# EAGLE design xmas_v2 (EAGLE 7.4.0)
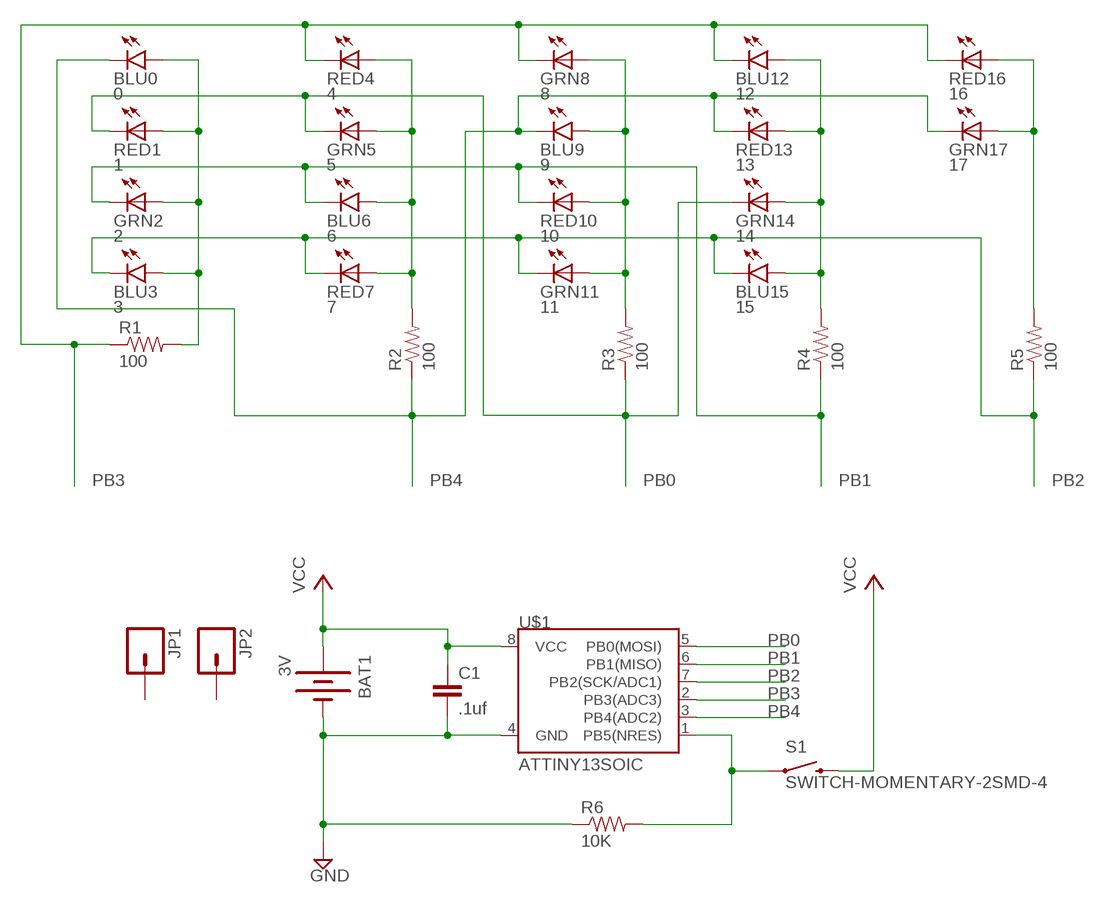
[diagram p0: schematic, sheet 1]

## Parts
BAT1  3V  BATTERY20PTH  [BATTCOM_20MM_PTH]
BLU0  0  LED5MM-KIT  [LED5MM-KIT]
BLU3  3  LED5MM-KIT  [LED5MM-KIT]
BLU6  6  LED5MM-KIT  [LED5MM-KIT]
BLU9  9  LED5MM-KIT  [LED5MM-KIT]
BLU12  12  LED5MM-KIT  [LED5MM-KIT]
BLU15  15  LED5MM-KIT  [LED5MM-KIT]
C1  .1uf  CAP0805  [0805]
GRN2  2  LEDCHIPLED_0805  [CHIPLED_0805]
GRN5  5  LEDCHIPLED_0805  [CHIPLED_0805]
GRN8  8  LEDCHIPLED_0805  [CHIPLED_0805]
GRN11  11  LEDCHIPLED_0805  [CHIPLED_0805]
GRN14  14  LEDCHIPLED_0805  [CHIPLED_0805]
GRN17  17  LEDCHIPLED_0805  [CHIPLED_0805]
JP1  M01NOSILK-KIT  [1X01NS-KIT]
JP2  M01NOSILK-KIT  [1X01NS-KIT]
R1  100  RESISTOR0805-RES  [0805]
R2  100  RESISTOR0805-RES  [0805]
R3  100  RESISTOR0805-RES  [0805]
R4  100  RESISTOR0805-RES  [0805]
R5  100  RESISTOR0805-RES  [0805]
R6  10K  RESISTOR0805-RES  [0805]
RED1  1  LEDCHIPLED_0805  [CHIPLED_0805]
RED4  4  LEDCHIPLED_0805  [CHIPLED_0805]
RED7  7  LEDCHIPLED_0805  [CHIPLED_0805]
RED10  10  LEDCHIPLED_0805  [CHIPLED_0805]
RED13  13  LEDCHIPLED_0805  [CHIPLED_0805]
RED16  16  LEDCHIPLED_0805  [CHIPLED_0805]
S1  SWITCH-MOMENTARY-2SMD-4  [TACTILE_SWITCH_TALL]
U$1  ATTINY13SOIC  [SO08]

## Nets
GND: BAT1.2(-) C1.2 R6.1 U$1.4(GND)
N$1: BLU0.A BLU3.A GRN2.A R1.2 RED1.A
N$2: BLU6.A GRN5.A R2.2 RED4.A RED7.A
N$3: BLU9.A GRN8.A GRN11.A R3.2 RED10.A
N$4: BLU12.A BLU15.A GRN14.A R4.2 RED13.A
N$5: GRN17.A R5.2 RED16.A
N$10: R6.2 S1.A2 U$1.1(PB5(NRES))
PB0: GRN5.C GRN14.C R3.1 RED1.C U$1.5(PB0(MOSI))
PB1: BLU6.K(C) GRN2.C R4.1 RED10.C U$1.6(PB1(MISO))
PB2: BLU3.K(C) BLU15.K(C) GRN11.C R5.1 RED7.C U$1.7(PB2(SCK/ADC1))
PB3: BLU12.K(C) GRN8.C R1.1 RED4.C RED16.C U$1.2(PB3(ADC3))
PB4: BLU0.K(C) BLU9.K(C) GRN17.C R2.1 RED13.C U$1.3(PB4(ADC2))
VCC: BAT1.1(+) C1.1 S1.B2 U$1.8(VCC)
Unconnected: JP1.1 JP2.1

## Library data of the parts
BAT1 = SparkFun-Electromechanical:BATTERY: Battery Holders Various common sizes : AA, AAA, 18650 (PRT-12895), 20mm coin cell and 12mm coin cell. 20MM_4LEGS, BATT-10373
BLU0 BLU3 BLU6 BLU9 BLU12 BLU15 = SparkFun-LED:LED: LEDs Standard schematic elements and footprints for 5mm, 3mm, 1206, and 0603 sized LEDs. 5mm - Spark Fun Electronics SKU : COM-00529 (and others)
C1 = SparkFun-Capacitors:CAP: Capacitor Standard 0603 ceramic capacitor, and 0.1" leaded capacitor.
GRN2 GRN5 GRN8 GRN11 GRN14 GRN17 RED1 RED4 RED7 RED10 RED13 RED16 = adafruit:LED: LED OSRAM: - CHIPLED LG R971, LG N971, LY N971, LG Q971, LY Q971, LO R971, LY R971 LH N974, LH R974 LS Q976, LO Q976, LY Q976 LO Q996 - Hyper CHIPLED LW Q18S LB Q993, LB Q99A, LB R99A - SideLED LS A670, LO A670, LY A670, LG A670, LP A670 LB A673, LV A673, LT A673, LW A673 LH A674 LY A675 LS A676, LA A676, LO A676, LY A676, LW A676 LS A679, LY A679, LG A679 - Hyper Micro SIDELED® LS Y876, LA Y876, LO Y876, LY Y876 LT Y87S - SmartLED LW L88C, LW L88S LB L89C, LB L89S, LG L890 LS L89K, LO L89K, LY L89K LS L896, LA L896, LO L896, LY L896 - TOPLED LS T670, LO T670, LY T670, LG T670, LP T670 LSG T670, LSP T670, LSY T670, LOP T670, LYG T670 LG T671, LOG T671, LSG T671 LB T673, LV T673, LT T673, LW T673 LH T674 LS T676, LA T676, LO T676, LY T676, LB T676, LH T676, LSB T676, LW T676 LB T67C, LV T67C, LT T67C, LS T67K, LO T67K, LY T67K, LW E67C LS E67B, LA E67B, LO E67B, LY E67B, LB E67C, LV E67C, LT E67C LW T67C LS T679, LY T679, LG T679 LS T770, LO T770, LY T770, LG T770, LP T770 LB T773, LV T773, LT T773, LW T773 LH T774 LS E675, LA E675, LY E675, LS T675 LS T776, LA T776, LO T776, LY T776, LB T776 LHGB T686 LT T68C, LB T68C - Hyper Mini TOPLED® LB M676 - Mini TOPLED Santana® LG M470 LS M47K, LO M47K, LY M47K Source: http://www.osram.convergy.de/
JP1 JP2 = SparkFun-Connectors:M01: Header 1 Standard 1-pin 0.1" header. Use with straight break away headers (SKU : PRT-00116), right angle break away headers (PRT-00553), swiss pins (PRT-00743), machine pins (PRT-00117), and female headers (PRT-00115). SMTSO-256-ET is a "flush mount" nut for a 4-40 screw. The older package used to be too tight, and did not allow it to sit properly thru the drill hit. The latest (0.165DIA) fits nice and snug.
R1-R6 = SparkFun-Passives:RESISTOR: Resistor Basic schematic elements and footprints for 0603, 1206, and PTH resistors.
S1 = SparkFun-Electromechanical:SWITCH-MOMENTARY-2: Various NO switches- pushbuttons, reed, etc; PROD_ID: SWCH-11966
U$1 = SparkFun-DigitalIC:ATTINY13: Atmel 8-pin 1kB flash uC

## Board
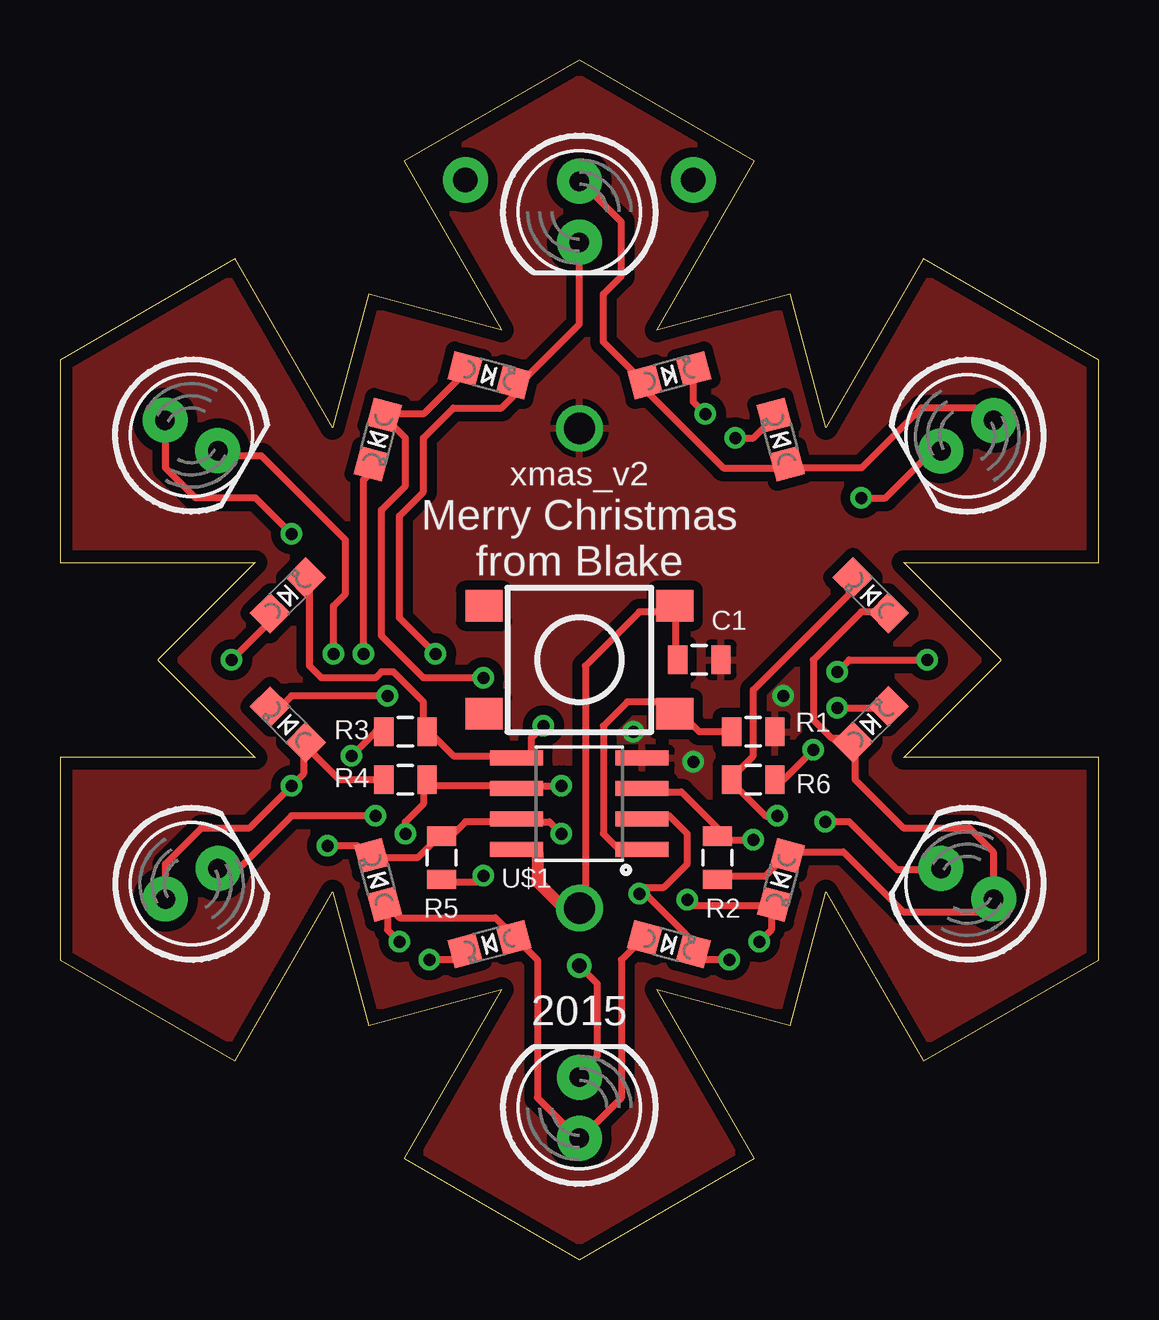
[diagram p1: board, top side]
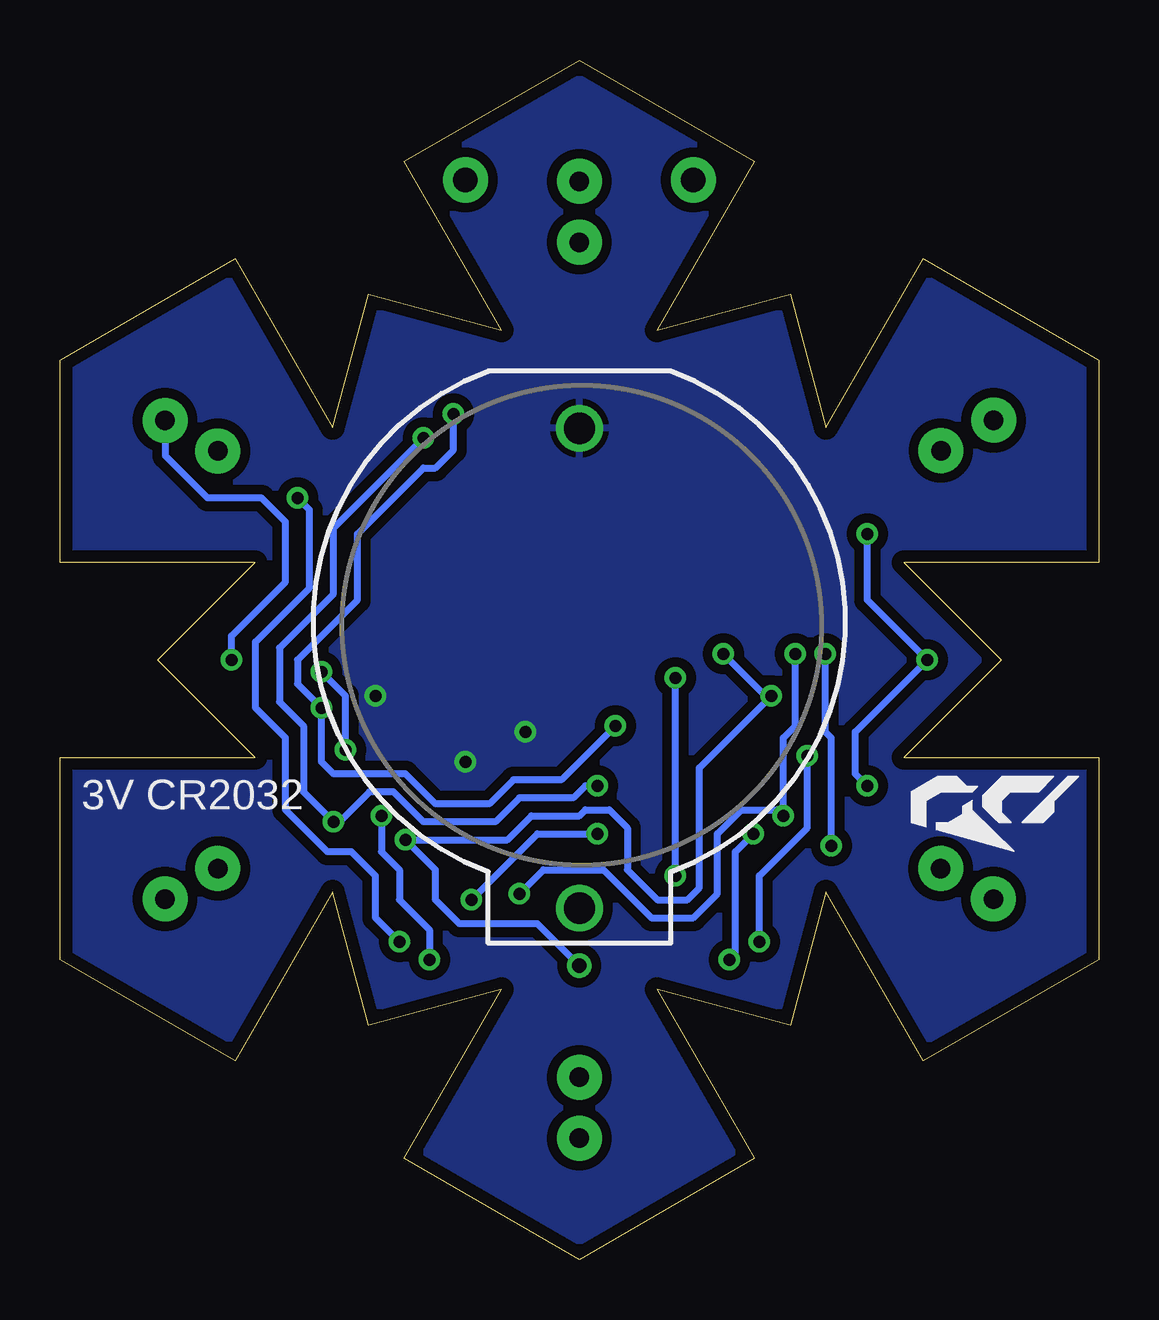
[diagram p2: board, bottom side, seen from below]

Size 43.3 x 50 mm. Coordinates in mm from the lower left corner, seen from the top.
Outline: 31.93,34.68 30.44,40.23 24.9,38.74 28.96,45.78 21.65,50 14.34,45.78 18.41,38.74 12.86,40.23 11.37,34.68 7.31,41.72 0,37.5 0,29.06 8.12,29.06 4.06,25 8.12,20.94 0,20.94 0,12.5 7.31,8.28 11.37,15.32 12.86,9.77 18.41,11.26 14.34,4.22 21.65,0 28.96,4.22 24.9,11.26 30.44,9.77 31.93,15.32 35.99,8.28 43.3,12.5 43.3,20.94 35.18,20.94 39.24,25 35.18,29.06 43.3,29.06 43.3,37.5 35.99,41.72 31.93,34.68
Copper layers (1*16): Top 0.035mm / dielectric 1.5mm / Bottom 0.035mm
Design rules "ITead_rule *": minimum track width 8mil, minimum drill 0.25mm, track to track 8mil, track to pad 8mil, pad to pad 8mil, via to via 8mil, smd to smd 8mil, copper to edge 20mil, drill to drill 10mil, minimum pad ring 12mil, minimum via ring 8mil, stop-mask expansion 4mil, vias tented up to drill 100mil, thermal gap 10mil

### Footprints (pad centres in the part's own frame; a part is rotated, then mirrored left to right if it is on the bottom)
BATTCOM_20MM_PTH = drill 1.3: 1 11.85,0; 2 -8.15,0
LED5MM-KIT = drill 0.813 pad 1.88: A -1.27,0; K 1.27,0
0805 = smd 0.8 x 1.2: 1 -0.9,0; 2 0.9,0
CHIPLED_0805 = smd 1.2 x 1.2: A 0,-1.05; C 0,1.05
1X01NS-KIT = drill 1.016 pad 1.88: 1 0,0
TACTILE_SWITCH_TALL = smd 1.55 x 1.3: A1 -3.975,-2.25; A2 3.975,-2.25; B1 -3.975,2.25; B2 3.975,2.25
SO08 = smd 0.61 x 2.21: 1 -1.905,-2.616; 2 -0.635,-2.616; 3 0.635,-2.616; 4 1.905,-2.616; 5 1.905,2.616; 6 0.635,2.616; 7 -0.635,2.616; 8 -1.905,2.616

### Placement (x,y rotation side)
BAT1  21.65,26.5 270 bottom
BLU0  21.65,43.67 270 top
BLU3  37.82,34.34 210 top
BLU6  37.82,15.66 150 top
BLU9  21.65,6.33 90 top
BLU12  5.49,15.66 30 top
BLU15  5.48,34.35 330 top
C1  26.65,25 0 top
GRN2  30.04,34.18 15 top
GRN5  33.8,22.32 315 top
GRN8  25.39,13.14 255 top
GRN11  13.26,15.82 15 top
GRN14  9.51,27.68 315 top
GRN17  17.9,36.86 255 top
JP1  26.4,45 0 top
JP2  16.9,45 0 top
R1  28.9,20 0 top
R2  27.4,16.75 270 top
R3  14.4,22 180 top
R4  14.4,20 180 top
R5  15.9,16.75 270 top
R6  28.9,22 180 top
RED1  25.4,36.86 285 top
RED4  33.79,27.69 45 top
RED7  30.05,15.82 165 top
RED10  17.9,13.15 105 top
RED13  9.51,22.3 45 top
RED16  13.25,34.18 165 top
S1  21.65,25 0 top
U$1  21.65,19 90 top

### Tracks (layer width: path | path; a pad name or v marks a point on that pad's centre or on a via)
GND  (via drill 0.5)
  other vias: 30.15,23.5 26.4,20.75 23.9,22
  pour Top (isolate 0.4): 31.93,34.68 30.44,40.23 24.9,38.74 28.96,45.78 21.65,50 14.34,45.78 18.41,38.74 12.86,40.23 11.37,34.68 7.31,41.72 0,37.5 0,29.06 8.12,29.06 4.06,25 8.12,20.94 0,20.94 0,12.5 7.31,8.28 11.37,15.32 12.86,9.77 18.41,11.26 14.34,4.22 21.65,0 28.96,4.22 24.9,11.26 30.44,9.77 31.93,15.32 35.99,8.28 43.3,12.5 43.3,20.94 35.18,20.94 39.24,25 35.18,29.06 43.3,29.06 43.3,37.5 35.99,41.72
  pour Bottom (isolate 0.4): 31.93,34.68 30.44,40.23 24.9,38.74 28.96,45.78 21.65,50 14.34,45.78 18.41,38.74 12.86,40.23 11.37,34.68 7.31,41.72 0,37.5 0,29.06 8.12,29.06 4.06,25 8.12,20.94 0,20.94 0,12.5 7.31,8.28 11.37,15.32 12.86,9.77 18.41,11.26 14.34,4.22 21.65,0 28.96,4.22 24.9,11.26 30.44,9.77 31.93,15.32 35.99,8.28 43.3,12.5 43.3,20.94 35.18,20.94 39.24,25 35.18,29.06 43.3,29.06 43.3,37.5 35.99,41.72
N$1  (via drill 0.5)
  Top 0.3: BLU3.A 38.65,35 38.15,35.5 35.9,35.5 33.4,33 30.65,33 GRN2.A 29.9,33 27.65,33 24.4,36.25 RED1.A 24.15,36.75 22.65,38.25 22.65,40.25 23.4,41 23.4,43.25 22.15,44.5 BLU0.A | R1.2 30.15,20 v31.4,21.25 | v32.4,24.5 32.9,25 v36.15,25
  Bottom 0.3: v31.4,21.25 31.4,23.5 v32.4,24.5 | v36.15,25 36.15,26 33.9,28.25 33.9,30.75 34.9,31.75 37.15,31.75 38.9,33.5 38.9,34.25 BLU3.A
N$2
  Top 0.3: RED4.A 34.65,27 33.4,27 31.4,25 31.4,22.5 32.15,21.75 32.65,21.75 32.65,21.5 GRN5.A 33.15,21.25 33.15,20 35.15,18 37.9,18 38.9,17 38.9,15.5 BLU6.A 38.4,14.5 35.15,14.5 32.65,17 30.65,17 | RED7.A 30.65,17 | R2.2 27.65,16 29.4,16 30.4,17 30.65,17
N$3  (via drill 0.5)
  Top 0.3: GRN8.A 24.15,13.25 23.4,12.5 23.4,6.75 21.9,5.25 BLU9.A 21.4,5.25 19.9,6.75 19.9,12.5 19.15,13.25 RED10.A 18.9,13.5 18.15,14.25 14.15,14.25 13.9,14.5 GRN11.A 13.65,14.5 13.65,13.75 v14.15,13.25 | v12.15,21 13.15,22 R3.2
  Bottom 0.3: v14.15,13.25 14.15,16 12.15,18 v12.15,21
N$4  (via drill 0.5)
  Top 0.3: BLU12.A 4.4,15.5 4.4,16.5 5.9,18 7.9,18 v9.65,19.75 10.15,20.25 10.15,21 RED13.A 10.4,21.25 11.65,20 R4.2 | GRN14.A 8.65,27 8.65,26.5 v7.15,25 | v9.65,30.25 8.15,31.75 5.65,31.75 4.4,33 4.4,34.25 BLU15.A
  Bottom 0.3: v9.65,19.75 10.15,20.25 10.15,22 v7.15,25 9.65,27.5 v9.65,30.25
N$5  (via drill 0.5)
  Top 0.3: R5.2 16.15,15.75 17.4,15.75 v17.65,16 | v17.65,24.25 15.15,24.25 13.4,26 13.4,31.25 14.4,32.25 14.4,34.25 13.65,35 RED16.A 13.9,35.25 15.15,35.25 16.65,36.75 16.65,37 GRN17.A
  Bottom 0.3: v17.65,16 v17.65,24.25
N$10
  Top 0.3: U$1.1 23.4,17 22.65,17.75 22.65,22.25 23.65,23.25 25.4,23.25 S1.A2 26.15,22.5 26.65,22 R6.2
PB0  (via drill 0.5)
  Top 0.3: GRN14.C 10.4,28.25 10.4,24.75 10.9,24.25 13.15,24.25 13.4,24.5 13.9,24.5 15.15,23.25 15.15,22.25 R3.1 15.4,22 16.4,21 18.15,21 U$1.5 19.65,21 19.65,21.75 v20.15,22.25 | v32.4,23 34.15,23 GRN5.C | v26.9,35.25 26.4,35.75 26.4,36.75 RED1.C
  Bottom 0.3: v20.15,22.25 22.4,20 24.4,20 25.4,19 27.65,19 28.9,20.25 31.9,20.25 32.4,20.75 v32.4,23 33.4,24 33.4,25 30.9,27.5 30.9,30.25 28.15,33 27.65,33 26.9,33.75 v26.9,35.25
PB1  (via drill 0.5)
  Top 0.3: R4.1 15.15,19.75 | RED10.C 16.65,12.75 16.4,12.5 v15.4,12.5 | 15.15,19.75 18.4,19.75 U$1.6 19.9,19.75 v20.9,19.75 | 15.15,19.75 15.15,19 14.4,18.25 v14.4,17.75 | BLU6.K 36.15,16.25 34.9,16.25 32.9,18.25 v31.9,18.25 | 29.4,35.25 GRN2.C 29.4,34.75 28.9,34.25 v28.15,34.25
  Bottom 0.3: v15.4,12.5 15.15,12.75 15.15,17 v14.4,17.75 | v20.9,19.75 21.4,19.75 21.9,19.25 24.15,19.25 25.15,18.25 28.15,18.25 29.4,19.5 30.4,19.5 31.65,18.25 v31.9,18.25 33.15,19.5 33.15,22.25 34.15,23.25 34.15,25.5 31.9,27.75 31.9,30.5 v28.15,34.25
PB2  (via drill 0.5)
  Top 0.3: v26.15,15 26.4,14.75 29.4,14.75 RED7.C 29.65,14.5 29.65,13.75 v29.15,13.25 | v20.9,17.75 20.4,18.25 19.9,18.25 U$1.7 18.15,18.25 16.9,18.25 16.4,17.75 R5.1 15.65,17.5 14.9,16.75 13.15,16.75 GRN11.C 12.65,17 12.4,17.25 v11.15,17.25 | v11.4,25.25 11.4,27.25 11.9,27.75 11.9,30 8.4,33.5 6.65,33.5 BLU15.K | v33.4,31.75 34.4,31.75 36.15,33.5 BLU3.K
  Bottom 0.3: v26.15,15 23.4,17.75 v20.9,17.75 | v29.15,13.25 30.15,14.25 30.15,16 31.15,17 32.15,17 33.9,18.75 33.9,21.75 35.15,23 35.15,25.75 32.9,28 32.9,31.25 v33.4,31.75 | v11.15,17.25 11.15,21.75 11.4,22 v11.4,25.25
PB3  (via drill 0.5)
  Top 0.3: U$1.2 25.15,18.5 25.4,18.5 26.15,17.75 26.15,16.5 25.15,15.5 24.4,15.5 v24.15,15.25 24.4,15.25 26.15,13.5 26.15,13.25 GRN8.C 26.65,12.5 v27.9,12.5 | v13.15,18.5 9.65,18.5 7.4,16.25 BLU12.K | v29.9,18.5 29.4,18.5 28.15,19.75 R1.1 28.15,20.25 28.9,21 28.9,23.75 32.9,27.75 32.9,28 RED4.C | v12.65,25.25 12.65,32.5 12.9,32.75 12.65,33 RED16.C
  Bottom 0.3: v24.15,15.25 23.15,16.25 20.65,16.25 18.65,14.25 16.9,14.25 15.9,15.25 15.9,17.75 14.9,18.75 13.4,18.75 v13.15,18.5 13.15,21.75 12.65,22.25 v12.65,25.25 | v29.9,18.5 29.9,17 29.15,16.25 29.15,15 27.9,13.75 v27.9,12.5
PB4  (via drill 0.5, 0.6 pad 1.02)
  Top 0.3: BLU0.K 21.65,39 19.15,36.5 GRN17.C 18.9,36 18.4,35.5 16.4,35.5 15.15,34.25 15.15,32 14.15,31 14.15,26.75 v15.65,25.25 | 27.4,17.75 R2.1 27.9,17.5 | BLU9.K 21.9,8 22.4,8.5 22.4,11.5 v21.65,12.25 | U$1.3 25.15,19.5 25.9,19.5 27.4,18 27.4,17.75 | 27.4,17.75 27.9,17.5 | 27.9,17.5 v28.9,17.5 | v13.65,23.5 9.65,23.5 9.15,23 RED13.C
  Bottom 0.3: v21.65,12.25 23.4,14 26.65,14 27.65,15 27.65,16.25 v28.9,17.5 24.65,17.5 23.65,18.5 21.65,18.5 21.4,18.75 20.4,18.75 19.65,18 19.65,16.25 18.4,15 17.15,15 16.65,15.5 16.65,20.5 v13.65,23.5 13.9,23.5 v15.65,25.25
VCC
  Top 0.3: S1.B2 25.65,27 | 25.65,27 24.15,27 21.9,24.75 21.9,15.25 BAT1.1 | 19.9,17 U$1.8 | 25.65,27 25.65,24.75 C1.1
  Top 0.5: 19.9,17 19.9,15.75 20.9,14.75 BAT1.1

### Text on the board
tPlace: xmas_v2 | Merry Christmas / from Blake | 2015
bPlace: 3V CR2032